# Altium project PIC16F_BOARD.PrjPcb
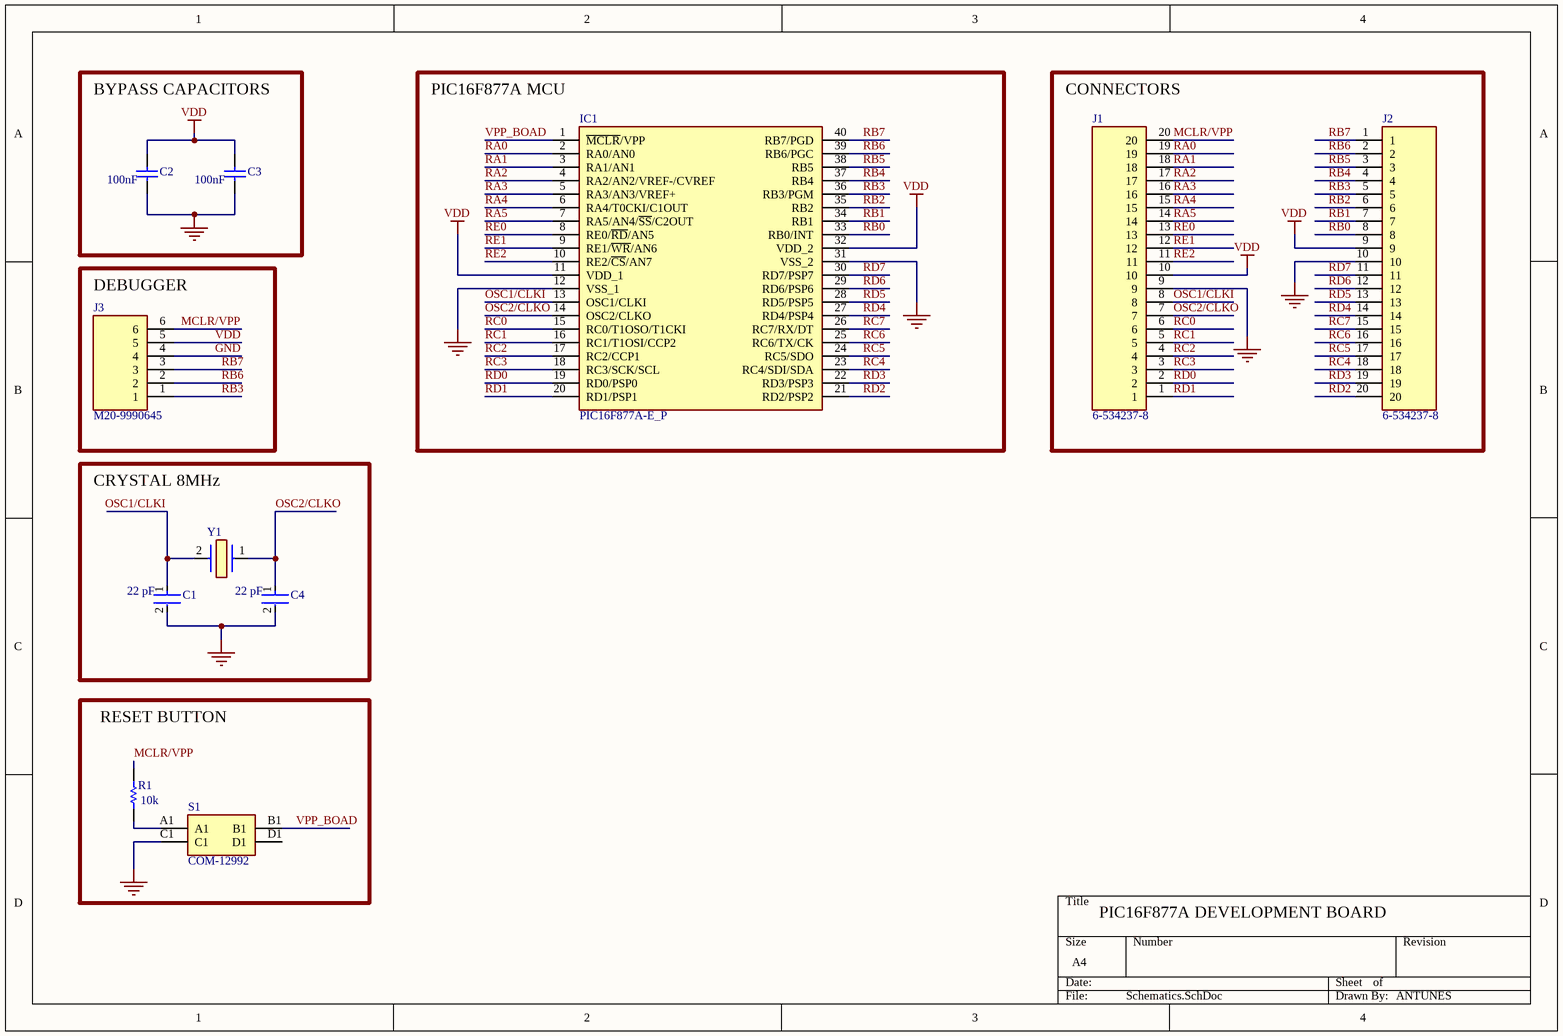
[diagram p0: Schematics.SchDoc]
1 sheet, 11 parts. Net scope: global (net labels, ports and power ports of the same name join across sheets).
Board file: BOARD.PcbDoc

## Sheet Schematics.SchDoc
size A4; SheetNumber: 1; SheetTotal: 1

### Parts
C1  value 22 pF  [FP-C0805C-DN-MFG]  (hidden comment: C0805C220J1GACTU)
C2  value 100nF  [CAPC2013X94X50LL20T25]  (hidden comment: 08055C104JAZ2A)
C3  value 100nF  [CAPC2013X94X50LL20T25]  (hidden comment: 08055C104JAZ2A)
C4  value 22 pF  [FP-C0805C-DN-MFG]  (hidden comment: C0805C220J1GACTU)
IC1  PIC16F877A-E_P  [DIP1550W56P254L5219H483Q40N]
J1  6-534237-8  [RHDR20W76P0X254_1X20_5080X356X889P]
J2  6-534237-8  [RHDR20W76P0X254_1X20_5080X356X889P]
J3  M20-9990645  [HDRV6W66P0X254_1X6_1524X254X874P]
R1  value 10k  [RESC2013X60X35NL10T20]  (hidden comment: RC0805FR-0710KL)
S1  COM-12992  [COM12992]
Y1  LFXTAL030234Reel  [LFXTAL030234Reel]  (value not drawn)

### Blocks framed on the sheet
BYPASS CAPACITORS: C2 C3
PIC16F877A MCU: IC1
CONNECTORS: J1 J2
DEBUGGER: J3
CRYSTAL 8MHz: C1 C4 Y1
RESET BUTTON: R1 S1

### Nets
GND: C1.2 C2.1 C3.1 C4.2 IC1.12(VSS_1) IC1.31(VSS_2) J1.9 J2.10 J3.4 S1.C1
VDD: C2.2 C3.2 IC1.11(VDD_1) IC1.32(VDD_2) J1.10 J2.9 J3.5
MCLR/VPP: J1.20 J3.6 R1.2
OSC1/CLKI: C1.1 IC1.13(OSC1/CLKI) J1.8 Y1.2(CRYSTAL_2)
OSC2/CLKO: C4.1 IC1.14(OSC2/CLKO) J1.7 Y1.1(CRYSTAL_1)
RA0: IC1.2(RA0/AN0) J1.19
RA1: IC1.3(RA1/AN1) J1.18
RA2: IC1.4(RA2/AN2/VREF-/CVREF) J1.17
RA3: IC1.5(RA3/AN3/VREF+) J1.16
RA4: IC1.6(RA4/T0CKI/C1OUT) J1.15
RA5: IC1.7(RA5/AN4/~{SS}/C2OUT) J1.14
RB0: IC1.33(RB0/INT) J2.8
RB1: IC1.34(RB1) J2.7
RB2: IC1.35(RB2) J2.6
RB3: IC1.36(RB3/PGM) J2.5 J3.1
RB4: IC1.37(RB4) J2.4
RB5: IC1.38(RB5) J2.3
RB6: IC1.39(RB6/PGC) J2.2 J3.2
RB7: IC1.40(RB7/PGD) J2.1 J3.3
RC0: IC1.15(RC0/T1OSO/T1CKI) J1.6
RC1: IC1.16(RC1/T1OSI/CCP2) J1.5
RC2: IC1.17(RC2/CCP1) J1.4
RC3: IC1.18(RC3/SCK/SCL) J1.3
RC4: IC1.23(RC4/SDI/SDA) J2.18
RC5: IC1.24(RC5/SDO) J2.17
RC6: IC1.25(RC6/TX/CK) J2.16
RC7: IC1.26(RC7/RX/DT) J2.15
RD0: IC1.19(RD0/PSP0) J1.2
RD1: IC1.20(RD1/PSP1) J1.1
RD2: IC1.21(RD2/PSP2) J2.20
RD3: IC1.22(RD3/PSP3) J2.19
RD4: IC1.27(RD4/PSP4) J2.14
RD5: IC1.28(RD5/PSP5) J2.13
RD6: IC1.29(RD6/PSP6) J2.12
RD7: IC1.30(RD7/PSP7) J2.11
RE0: IC1.8(RE0/~{RD}/AN5) J1.13
RE1: IC1.9(RE1/~{WR}/AN6) J1.12
RE2: IC1.10(RE2/~{CS}/AN7) J1.11
VPP_BOAD: IC1.1(~{MCLR}/VPP) S1.B1
NetR1_1: R1.1 S1.A1

Not connected (* = marked no-connect by the designer): S1 D1

### Notes on the sheet
- PIC16F877A DEVELOPMENT BOARD
- ANTUNES

### Library data of the parts
C1 C4 = CMP-2007-00448-2: CAP CER 22PF 100V 5% NP0 0805; Manufacturer: KEMET; Material: Ceramic; Temperature Coefficient: 30ppm/°C; Tolerance: 0.05; Temperature Characteristic: C0G; RoHS: TRUE; ComponentLink2URL: https://content.kemet.com/datasheets/KEM_C1003_C0G_SMD.pdf; Capacitance: 22 pF; Mouser Description: Multilayer Ceramic Capacitor, C Series, 22 Pf, - 5%, C0g / Np0, 100 V, 0805 [2012 Metric] Rohs Compliant: Yes; Digikey Description: CAP CER 22PF 100V 5% NP0 0805; Octopart: https://octopart.com/c0805c220j1gactu-kemet-3791395; Device Class L3: Ceramic Capacitors; Device Class L2: Capacitors; Voltage Rating: 100 V; Temperature Range Low: -55°C; Ipc Land Pattern Name: CAPC200125X78; Lead Free: Yes; ComponentLink2Description: Datasheet; Manufacturer Part Number: C0805C220J1GACTU; Category: Cap; Temperature: -55°C to +125°C; Package: C0805C-DN; Device Class L1: Passive Components; Temperature Range High: +125°C; Height: 0.88mm; Automotive: No
C2 C3 = CMP-2007-04369-1: Manufacturer: AVX Interconnect / Elco; Part Number: 08055C104JAZ2A
IC1 = PIC16F877A-E_P: Integrated Circuit; Manufacturer_Name: Microchip; Manufacturer_Part_Number: PIC16F877A-E/P; Datasheet Link: https://datasheet.datasheetarchive.com/originals/distributors/Datasheets-18/DSA-359049.pdf; Height: 4.83mm; Mouser Part Number: 579-PIC16F877A-E/P; Mouser Price/Stock: https://www.mouser.co.uk/ProductDetail/Microchip-Technology/PIC16F877A-E-P?qs=oKK8NaWdAJsQw%252B2Y417CHw%3D%3D; Arrow Part Number: PIC16F877A-E/P; Arrow Price/Stock: https://www.arrow.com/en/products/pic16f877a-ep/microchip-technology?region=nac
J1 J2 = 6-534237-8: Connector; Manufacturer_Name: TE Connectivity; Datasheet Link: https://componentsearchengine.com/Datasheets/1/6-534237-8.pdf; Height: 8.89mm; Manufacturer_Part_Number: 6-534237-8; Mouser Part Number: 571-6-534237-8; Mouser Price/Stock: https://www.mouser.co.uk/ProductDetail/TE-Connectivity/6-534237-8?qs=xDp7PGUNC%252BtPvTSnQ1ELZA%3D%3D; Arrow Part Number: 6-534237-8; Arrow Price/Stock: https://www.arrow.com/en/products/6-534237-8/te-connectivity
J3 = M20-9990645: Connector; Manufacturer_Name: Harwin; Datasheet Link: https://cdn.harwin.com/pdfs/M20-999.pdf; Height: 8.74mm; Manufacturer_Part_Number: M20-9990645; Mouser Part Number: 855-M20-9990645; Mouser Price/Stock: https://www.mouser.co.uk/ProductDetail/Harwin/M20-9990645?qs=Jph8NoUxIfWe7BJQOhiVRg%3D%3D
R1 = CMP-1659-00013-4: Chip Resistor, 10 KOhm, +/- 1%, 0.125 W, -55 to 155 degC, 0805 (2012 Metric), RoHS, Tape and Reel; Manufacturer: Yageo; Voltage Rating: 150 V; Mount: Surface Mount; ComponentLink1Description: Manufacturer URL; ComponentLink2URL: http://www.yageo.com/documents/recent/PYu-RC_Group_51_RoHS_L_04.pdf; Pins: 2; Length: 2 mm; Min Operating Temperature: -55 degC; Height: 0.5 mm; Mounting Technology: Surface Mount; RoHSCompliant: true; REACH SVHC: No SVHC; ComponentLink1URL: http://www.yageo.com/; Max Operating Temperature: 155 degC; PackageReference: 0805; DatasheetVersion: Rev. 4, 02/2016; Package Quantity: 5000; Packaging: Tape and Reel; ComponentLink2Description: Datasheet; PackageDescription: 2-Pin Surface Mounted Device, Body 2 x 1.25 mm
S1 = COM-12992: Switch; Manufacturer_Name: SparkFun; Datasheet Link: https://cdn.sparkfun.com/datasheets/Components/Switches/COM-12922_datasheet%20SW-033.jpg; Height: 7.1mm; Manufacturer_Part_Number: COM-12992; Mouser Part Number: 474-COM-12992; Mouser Price/Stock: https://www.mouser.co.uk/ProductDetail/SparkFun/COM-12992?qs=WyAARYrbSnYTYDS2ryqd9A%3D%3D; Arrow Part Number: COM-12992; Arrow Price/Stock: https://www.arrow.com/en/products/com-12992/sparkfun-electronics?region=nac
Y1 = LFXTAL030234Reel: Crystal or Oscillator; Manufacturer_Name: IQD; Datasheet Link: https://www.mouser.fr/datasheet/2/741/LFXTAL030234Reel-996371.pdf; Height: 4.3mm; Manufacturer_Part_Number: LFXTAL030234Reel; Mouser Part Number: 449-LFXTAL030234REEL; Mouser Price/Stock: https://www.mouser.co.uk/ProductDetail/IQD/LFXTAL030234Reel?qs=e4%2FAndAAwgKRGsJIO2WnVQ%3D%3D; Arrow Part Number: LFXTAL030234REEL; Arrow Price/Stock: https://www.arrow.com/en/products/lfxtal030234reel/iqd-frequency-products